# EasyEDA Pro project VerificationBoard.eprj

# Schematic Schematic1
Create Date: 2023-01-30; Page Name: P1; Project Name: VerificationBoard; Schematic Name: Schematic1; Update Date: 2023-02-04
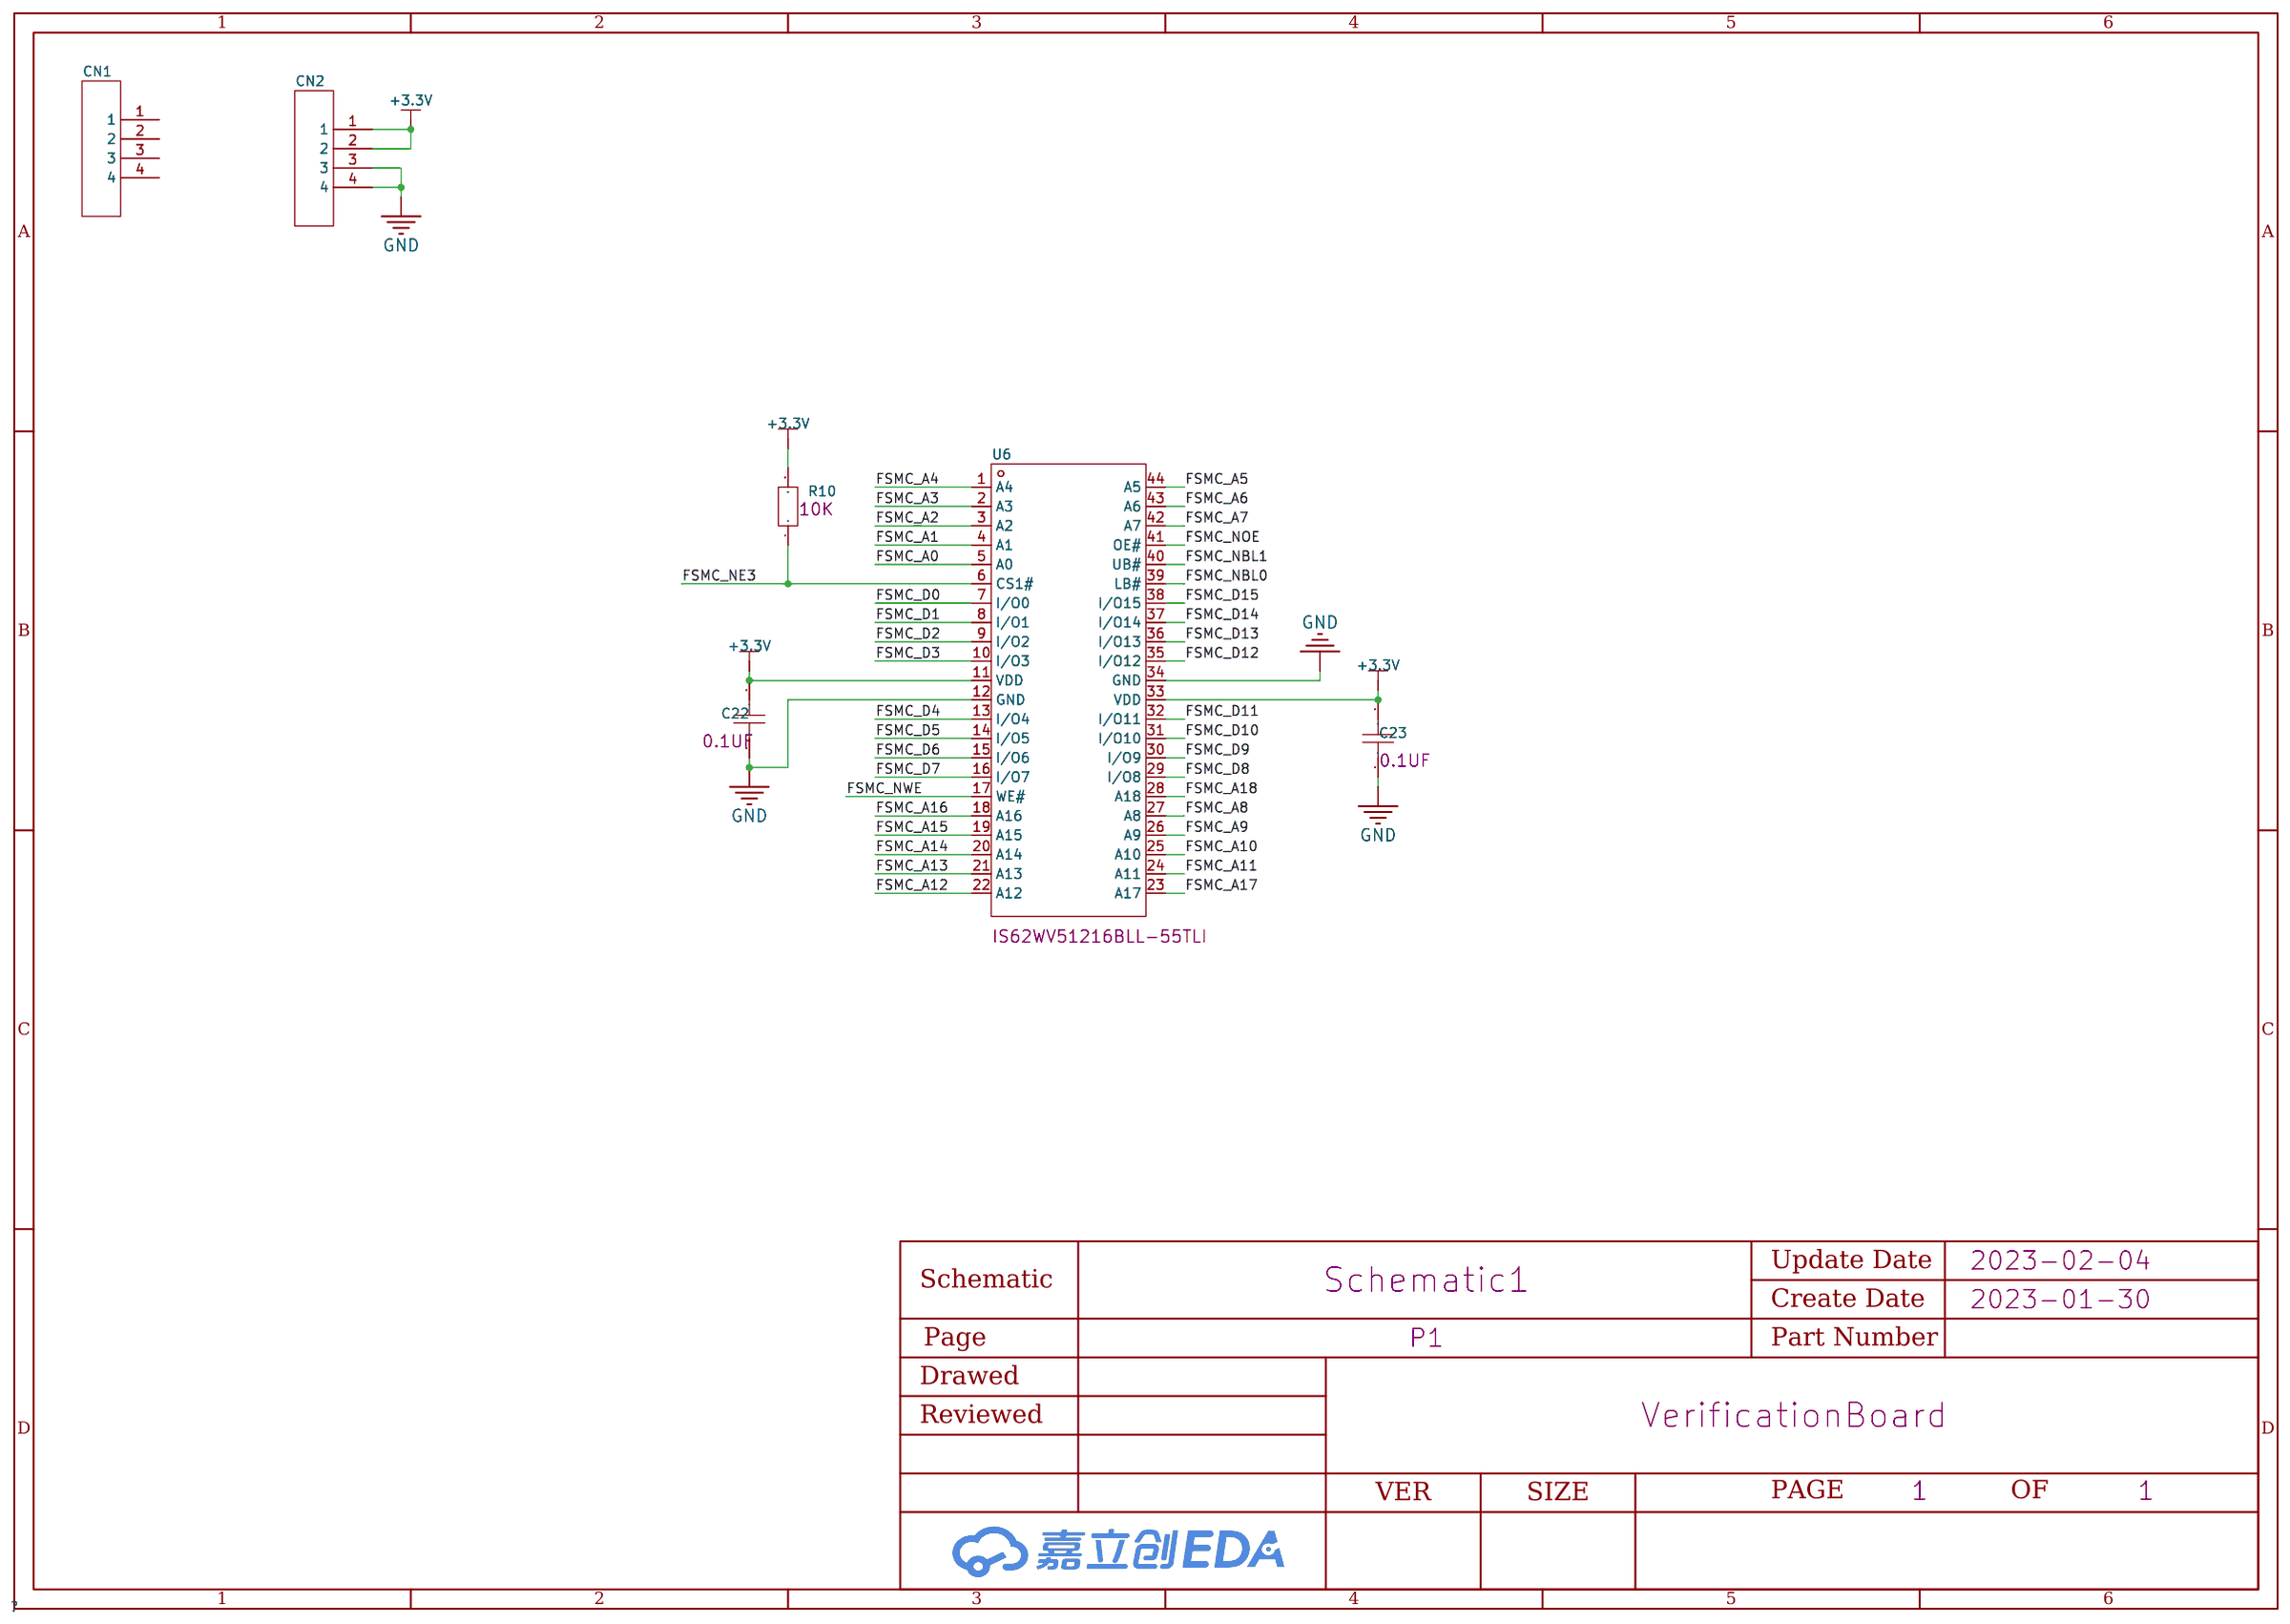
[diagram p0: schematic sheet]

## Parts
C22  -  [0603]
C23  -  [0603]
CN1  -  [2.54-4P插孔洞]  (no BOM)
CN2  -  [2.54-4P插孔洞]  (no BOM)
R10  -  [0603]
U6  IS62WV51216BLL-55TLI  [TSOP-44_L18.4-W10.2-P0.80-LS11.8-BL]

## Library data of the parts
C22 C23 = 电容: 0603 标准贴片电容; Capacitance: 0.1UF
CN1 CN2 = 2.54-4P插孔
R10 = 电阻: 0603 标准贴片电阻; Resistance: 10K
U6 = IS62WV51216BLL-55TLI: 8-Mbit(512K  16bit)，并行接口，工作电压：2.5V to 3.6V; Supplier Part: C11315; Manufacturer: ISSI(美国芯成); Supplier Footprint: TSOP-44-10.2mm; JLCPCB Part Class: Extended Part; Datasheet: https://atta.szlcsc.com/upload/public/pdf/source/20130225/1457706593006.pdf; Supplier: LCSC

## Nets
+3.3V: C22.2 C23.2 CN2.1 CN2.2 R10.2 U6.11(VDD) U6.33(VDD)
GND: C22.1 C23.1 CN2.3 CN2.4 U6.12(GND) U6.34(GND)
FSMC_A0: U6.5(A0)
FSMC_A1: U6.4(A1)
FSMC_A2: U6.3(A2)
FSMC_A3: U6.2(A3)
FSMC_A4: U6.1(A4)
FSMC_A5: U6.44(A5)
FSMC_A6: U6.43(A6)
FSMC_A7: U6.42(A7)
FSMC_A8: U6.27(A8)
FSMC_A9: U6.26(A9)
FSMC_A10: U6.25(A10)
FSMC_A11: U6.24(A11)
FSMC_A12: U6.22(A12)
FSMC_A13: U6.21(A13)
FSMC_A14: U6.20(A14)
FSMC_A15: U6.19(A15)
FSMC_A16: U6.18(A16)
FSMC_A17: U6.23(A17)
FSMC_A18: U6.28(A18)
FSMC_D0: U6.7(I/O0)
FSMC_D1: U6.8(I/O1)
FSMC_D2: U6.9(I/O2)
FSMC_D3: U6.10(I/O3)
FSMC_D4: U6.13(I/O4)
FSMC_D5: U6.14(I/O5)
FSMC_D6: U6.15(I/O6)
FSMC_D7: U6.16(I/O7)
FSMC_D8: U6.29(I/O8)
FSMC_D9: U6.30(I/O9)
FSMC_D10: U6.31(I/O10)
FSMC_D11: U6.32(I/O11)
FSMC_D12: U6.35(I/O12)
FSMC_D13: U6.36(I/O13)
FSMC_D14: U6.37(I/O14)
FSMC_D15: U6.38(I/O15)
FSMC_NBL0: U6.39(LB#)
FSMC_NBL1: U6.40(UB#)
FSMC_NE3: R10.1 U6.6(CS1#)
FSMC_NOE: U6.41(OE#)
FSMC_NWE: U6.17(WE#)

Not connected (* = marked no-connect by the designer): CN1 1 2 3 4

# Board PCB1
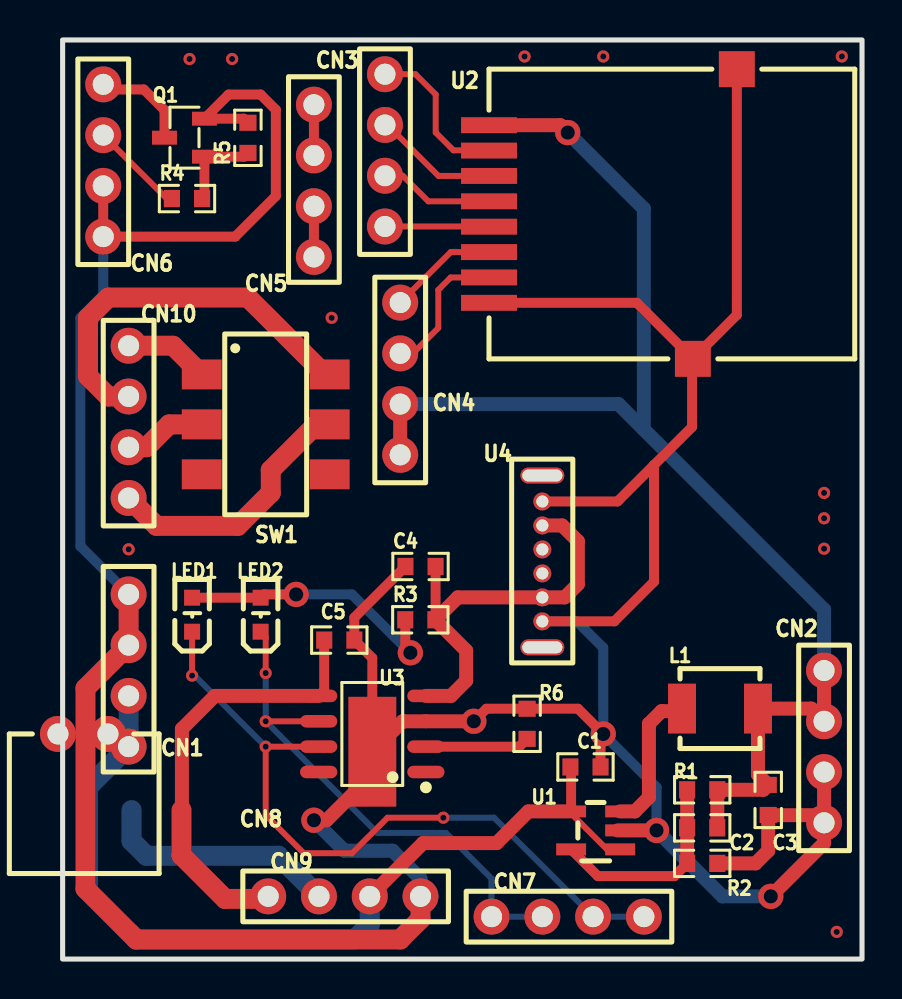
[diagram p1: board, top side]
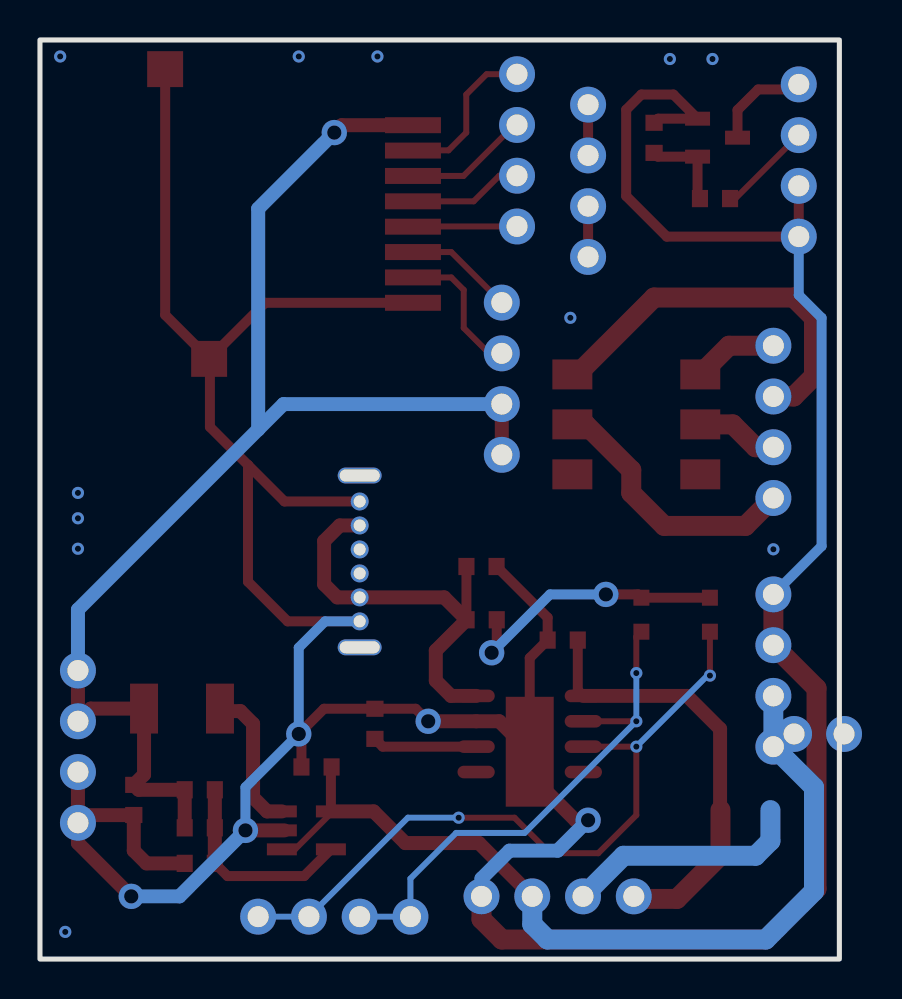
[diagram p2: board, bottom side, seen from below]

Outline 40 x 46 mm; copper layers: Top Layer, Bottom Layer. Coordinates in mm from the lower left corner of the outline.
Outline path: rectangle 0,46 40,0
Stack: Top Layer 0.035mm / Dielectric1 1.51mm FR4 er 4.5 / Bottom Layer 0.035mm

## Design rules (mm)
spacing safeClearance (default): track to track 0.152, other pairs 0.152 to 0.3
track width trackWidth (default): min 0.127, default 0.254, max 2.54
differential pair differentialPair (default): width min 0.127, default 0.254, max 2.54; gap min 0.152, default 0.152
via viaSize (default): diameter min 0.5, default 0.61, max 10; hole min 0.3, default 0.305, max 6

## Placement (name value [footprint] x y rotation side)
C1  -  [0603]  26.16 9.61 180 top
C2  -  [0603]  32 6.57 0 top
C3  -  [0603]  35.31 7.96 90 top
C4  -  [0603]  17.91 19.65 0 top
C5  -  [0603]  13.84 15.96 180 top
CN1  -  [2.54-4P插孔洞]  3.3 10.63 90 top
CN2  -  [2.54-4P插孔洞]  38.1 14.44 270 top
CN3  -  [2.54-4P插孔洞]  16.13 44.28 270 top
CN4  -  [2.54-4P插孔洞]  16.89 32.85 270 top
CN5  -  [2.54-4P插孔洞]  12.57 35.14 90 top
CN6  -  [2.54-4P插孔洞]  2.03 43.78 270 top
CN7  -  [2.54-4P插孔洞]  21.46 2.12 0 top
CN8  -  [XH2.54插件2P]  1.02 7.45 0 top
CN9  -  [2.54-4P插孔洞]  10.29 3.14 0 top
CN10  -  [2.54-4P插孔洞]  3.3 30.7 270 top
L1  2.2uH  [IND-SMD_L4.0-W4.0_0.47UH04209.5A]  32.89 12.53 0 top
LED1  NCD0603R3  [LED0603-R-RD_RED]  6.48 17.23 90 top
LED2  NCD0603R3  [LED0603-R-RD_RED]  9.91 17.23 90 top
Q1  SS8050  [SOT-23-3_L2.9-W1.3-P1.90-LS2.4-BR]  6.1 41.11 0 top
R1  -  [0603]  32 8.47 0 top
R2  -  [0603]  32 4.79 180 top
R3  -  [0603]  17.9 16.98 0 top
R4  -  [0603]  6.22 38.06 0 top
R5  -  [0603]  9.27 41.1 90 top
R6  -  [0603]  23.24 11.77 90 top
SW1  -  [MST-22开关]  10.16 26.76 0 top
U1  -  [PW2051]  26.67 6.44 0 top
U2  -  [GT-24]  21.34 44.54 0 top
U3  -  [PW4056]  15.49 11.26 90 top
U4  -  [typec]  24 19.9 90 top

## Footprints (pads in the part's own frame, mm; a bottom-side part is the same pattern mirrored in y, then rotated)
2.54-4P插孔洞
  round 1.8 hole 1.05: 1(0,0) 2(2.54,0) 3(5.08,0) 4(7.62,0)
0603
  rect 0.806x0.864 smd: 1(-0.753,0) 2(0.753,0)
GT-24
  rect 2.8x0.8 smd: 1(0,-2.805) 2(0,-4.075) 3(0,-5.345) 4(0,-6.615) 5(0,-7.885) 6(0,-9.155) 7(0,-10.425) 8(0,-11.695)
  rect 1.8x1.8 smd: 9(12.4,0) 10(10.2,-14.5)
IND-SMD_L4.0-W4.0_0.47UH04209.5A
  rect 1.399x2.499 smd: 1(-1.9,0) 2(1.9,0)
LED0603-R-RD_RED
  rect 0.8x0.8 smd: 1(0.851,0) 2(-0.851,0)
MST-22开关
  rect 2x1.5 smd: 1(-3.2,2.5) 2(3.2,2.5) 3(-3.2,0) 4(3.2,0) 5(-3.2,-2.5) 6(3.2,-2.5)
PW2051
  rect 1.5x0.6 smd: 1(1.227,-0.95) 2(1.227,0) 3(1.227,0.95) 4(-1.227,0.95) 5(-1.227,-0.95)
PW4056
  oval 0.63x1.865 smd: 1(-1.905,-2.683) 2(-0.635,-2.683) 3(0.635,-2.683) 4(1.905,-2.683) 5(1.905,2.683) 6(0.635,2.683) 7(-0.635,2.683) 8(-1.905,2.683)
  rect 5.5x2.4 smd: 9(-0.889,0)
SOT-23-3_L2.9-W1.3-P1.90-LS2.4-BR
  rect 1.25x0.7 smd: 1(1,-0.95) 2(1,0.95) 3(-1,0)
typec
  round 0.9 hole 0.6: 1(-3,0) 2(-1.8,0) 3(-0.6,0) 4(0.6,0) 5(1.8,0) 6(3,0)
  oval 0.8x2.2 hole 0.6x2: 7(-4.3,0) 8(4.3,0)
XH2.54插件2P
  round 1.8 hole 1.05: 1(1.25,3.81) 2(-1.25,3.81)

## Nets
+3.3V: C2.2 C3.2 CN2.1 CN2.2 CN4.3 CN4.4 L1.2 R1.2 U2.1
+3.7V: C1.2 CN1.1 CN1.2 CN9.3 U1.1 U1.4
+5V: C4.2 R3.2 U3.4 U4.2 U4.5
GND: C1.1 C3.1 C4.1 C5.1 CN1.3 CN1.4 CN2.3 CN2.4 CN6.3 CN6.4 CN9.4 Q1.2 R2.1 R5.2 R6.2 U1.2 U2.8 U2.9 U2.10 U3.3 U3.9 U4.1 U4.6
OP: CN6.2 R4.1
SOUND-: CN6.1 Q1.3
$1N458: CN10.4 SW1.4
$1N1165: L1.1 U1.3
$1N1197: C2.1 R1.1 R2.2 U1.5
$1N2796: CN3.1 U2.2
$1N2813: CN3.2 U2.3
$1N2830: CN3.3 U2.4
$1N2847: CN3.4 U2.5
$1N2864: CN4.1 U2.6
$1N2879: CN4.2 U2.7
$1N3532: Q1.1 R4.2 R5.1
$1N4439: CN5.1 CN5.2
$1N4485: CN5.3 CN5.4
$1N5313: CN10.1 SW1.1
$1N5402: CN10.3 SW1.3
$1N5799: C5.2 CN8.1 CN9.1 U3.5
$1N5821: CN8.2 CN9.2
$1N6560: CN10.2 SW1.2
$1N7622: CN7.3 CN7.4 LED1.2 U3.7
$1N7734: CN7.1 CN7.2 LED2.2 U3.6
$1N7769: LED1.1 LED2.1 R3.1
$1N9103: R6.1 U3.2

Pads without a net: SW1 5 6; U3 1 8; U4 3 4 7 8

## Via types
v1: diameter 0.61, hole 0.305, Top Layer to Bottom Layer, 16 vias
v2: diameter 1.27, hole 0.711, Top Layer to Bottom Layer, 8 vias

## Routing (per net, layer and track width the routed paths; a pad name or vN(x,y) marks a point on that pad's centre or on a via; arc(x,y) is an arc through that point)
+3.3V: length 66.3
  Top Layer w0.7: 21.34,41.73 24.9,41.73 v2(25.27,41.36) ; CN2.1 CN2.2 37.47,12.53 L1.2 34.79,9.23 C3.2 35.06,8.47 R1.2 C2.2 ; CN4.3 CN4.4
  Bottom Layer w0.7: 29.08,26.51 29.08,37.56 v2(25.27,41.36) ; 29.08,26.51 38.1,17.49 CN2.1 ; 29.08,26.51 27.81,27.77 CN4.3
+3.7V: length 44.8
  Top Layer w0.3: U1.1 27.24,5.49 25.44,7.28 U1.4
  Top Layer w0.5: C1.2 25.44,9.58 U1.4
  Top Layer w0.7: U1.4 23.3,7.39 21.72,5.8 18.03,5.8 CN9.3
  Bottom Layer w1: CN9.3 15.37,1.74 14.6,0.98 3.68,0.98 1.27,3.39 1.27,8.6 CN1.1 CN1.2
+5V: length 20.8
  Top Layer w0.5: C4.2 18.66,16.99
  Top Layer w0.7: U3.4 19.43,13.17 20.19,13.93 20.19,15.44 18.65,16.98 ; U4.5 25,21.7 25.78,20.92 25.78,18.76 25.12,18.1 U4.2 19.77,18.1 18.66,16.99
GND: length 204.4
  Top Layer w0.5: 29.59,24.72 31.5,26.63 31.5,30 31.54,30.04 ; 29.59,24.72 27.76,22.9 U4.6 ; 29.59,24.72 29.59,24.72 29.59,18.88 27.61,16.9 U4.1 ; v2(20.57,11.9) 21.2,12.53 R6.2 25.79,12.53 v2(27.05,11.26) 26.92,11.13 C1.1 ; R5.2 9.07,42.06 Q1.2 8.31,43.27 9.91,43.27 10.67,42.51 10.67,38.19 8.64,36.16 CN6.4 CN6.3 ; 31.54,30.04 33.74,32.24 U2.9 ; 31.54,30.04 28.73,32.84 U2.8 ; U3.9 15.49,15.07 C5.1 14.6,17.09 C4.1
  Top Layer w0.7: v2(20.57,11.9) U3.3 17.02,11.9 U3.9 15.49,9.23 13.21,6.95 v2(12.57,6.95) ; CN2.4 37.72,7.2 35.31,7.2 C3.1 35.31,5.42 34.67,4.79 R2.1 ; CN2.4 CN2.3 ; CN2.4 38.1,5.8 v2(35.43,3.14) ; v2(29.72,6.44) 27.77,6.44
  Top Layer w1: CN1.4 CN1.3 1.14,13.55 1.14,3.52 3.68,0.98 16.89,0.98 17.91,1.99 CN9.4
  Bottom Layer w0.5: v2(29.72,6.44) 29.72,8.6 v2(27.05,11.26) 27.05,15.58 25.73,16.9 U4.1 ; CN1.4 0.89,20.66 0.89,32.09 2.03,33.24 CN6.4
  Bottom Layer w0.7: v2(29.72,6.44) 33.02,3.14 v2(35.43,3.14) ; v2(12.57,6.95) 14.1,5.42 16.51,5.42 17.91,4.03 CN9.4
  vias: v1(3.3,20.51) v1(6.35,45.05) v1(8.48,45.05) v1(13.46,32.09) v1(23.11,45.17) v1(27.05,45.17) v1(38.1,23.33) v1(38.1,22.06) v1(38.1,20.54) v1(38.73,1.36) v1(38.99,45.17)
OP: length 4.8
  Top Layer w0.3: R4.1 5.21,38.06 CN6.2
SOUND-: length 5
  Top Layer w0.5: Q1.3 5.1,42.49 4.06,43.52 2.29,43.52 CN6.1
$1N458: length 13.4
  Top Layer w1: SW1.4 12.7,26.76 10.41,24.47 10.41,23.33 8.76,21.68 4.7,21.68 CN10.4
$1N1165: length 7.4
  Top Layer w0.7: L1.1 30.87,12.41 29.97,12.41 29.34,11.77 29.34,8.09 28.64,7.39 U1.3
$1N1197: length 10.3
  Top Layer w0.5: U1.5 26.78,4.15 30.62,4.15 R2.2
  Top Layer w0.7: R2.2 C2.1 R1.1
$1N2796: length 7.1
  Top Layer w0.3: U2.2 21.32,40.47 19.56,40.47 18.67,41.36 18.67,43.27 17.65,44.28 16.89,44.28
$1N2813: length 6.1
  Top Layer w0.3: U2.3 18.81,39.19 16.26,41.74
$1N2830: length 5
  Top Layer w0.3: U2.4 18.3,37.92 17.02,39.2 16.89,39.2
$1N2847: length 4.4
  Top Layer w0.3: 21.34,36.65 21.32,36.66 16.89,36.66
$1N2864: length 5.5
  Top Layer w0.3: U2.6 19.42,35.38 CN4.1
$1N2879: length 7.1
  Top Layer w0.3: CN4.2 17.53,30.31 18.8,31.58 18.8,33.49 19.42,34.11 U2.7
$1N3532: length 4.4
  Top Layer w0.5: R5.1 9.08,40.16 Q1.1 7.1,38.18 R4.2
$1N4439: length 2.5
  Top Layer w0.5: CN5.2 CN5.1
$1N4485: length 2.5
  Top Layer w0.5: CN5.4 CN5.3
$1N5313: length 4.3
  Top Layer w1: SW1.1 5.52,30.7 CN10.1
$1N5402: length 4.1
  Top Layer w1: SW1.3 5.33,26.76 4.19,25.62 CN10.3
$1N5799: length 22.1
  Top Layer w0.5: C5.2 13.09,13.45 U3.5
  Top Layer w0.7: U3.5 7.62,13.17 5.97,11.52 5.97,7.47 5.95,7.45
  Top Layer w1: 5.95,7.45 5.95,5.19 8.13,3.01 10.16,3.01 CN9.1
$1N5821: length 12.1
  Bottom Layer w1: CN9.2 10.79,5.17 4.19,5.17 3.45,5.91 3.45,7.45
$1N6560: length 19.5
  Top Layer w1: SW1.2 13.12,29.26 9.27,33.11 2.29,33.11 1.27,32.09 1.27,29.17 2.29,28.16 CN10.2
$1N7622: length 35.9
  Top Layer w0.3: 12.81,10.63 v1(10.16,10.63) 10.16,7.2 12.06,5.3 14.48,5.3 16.26,7.07 v1(19.05,7.07) ; v1(6.48,14.19) LED1.2
  Bottom Layer w0.3: v1(10.16,10.63) 6.6,14.19 v1(6.48,14.19) ; CN7.4 CN7.3 21.59,7.07 v1(19.05,7.07)
$1N7734: length 26.2
  Top Layer w0.3: U3.6 v1(10.16,11.9) ; v1(10.16,14.31) 10.16,16.13 LED2.2
  Bottom Layer w0.3: CN7.2 CN7.1 21.46,4.03 19.18,6.31 15.75,6.31 v1(10.16,11.9) v1(10.16,14.31)
$1N7769: length 14
  Top Layer w0.5: LED1.1 LED2.1 10.07,18.25 v2(11.68,18.25) ; R3.1 17.15,15.58 v2(17.4,15.33)
  Bottom Layer w0.5: v2(17.4,15.33) 14.48,18.25 v2(11.68,18.25)
$1N9103: length 5.2
  Top Layer w0.5: R6.1 22.85,10.63 18.18,10.63
